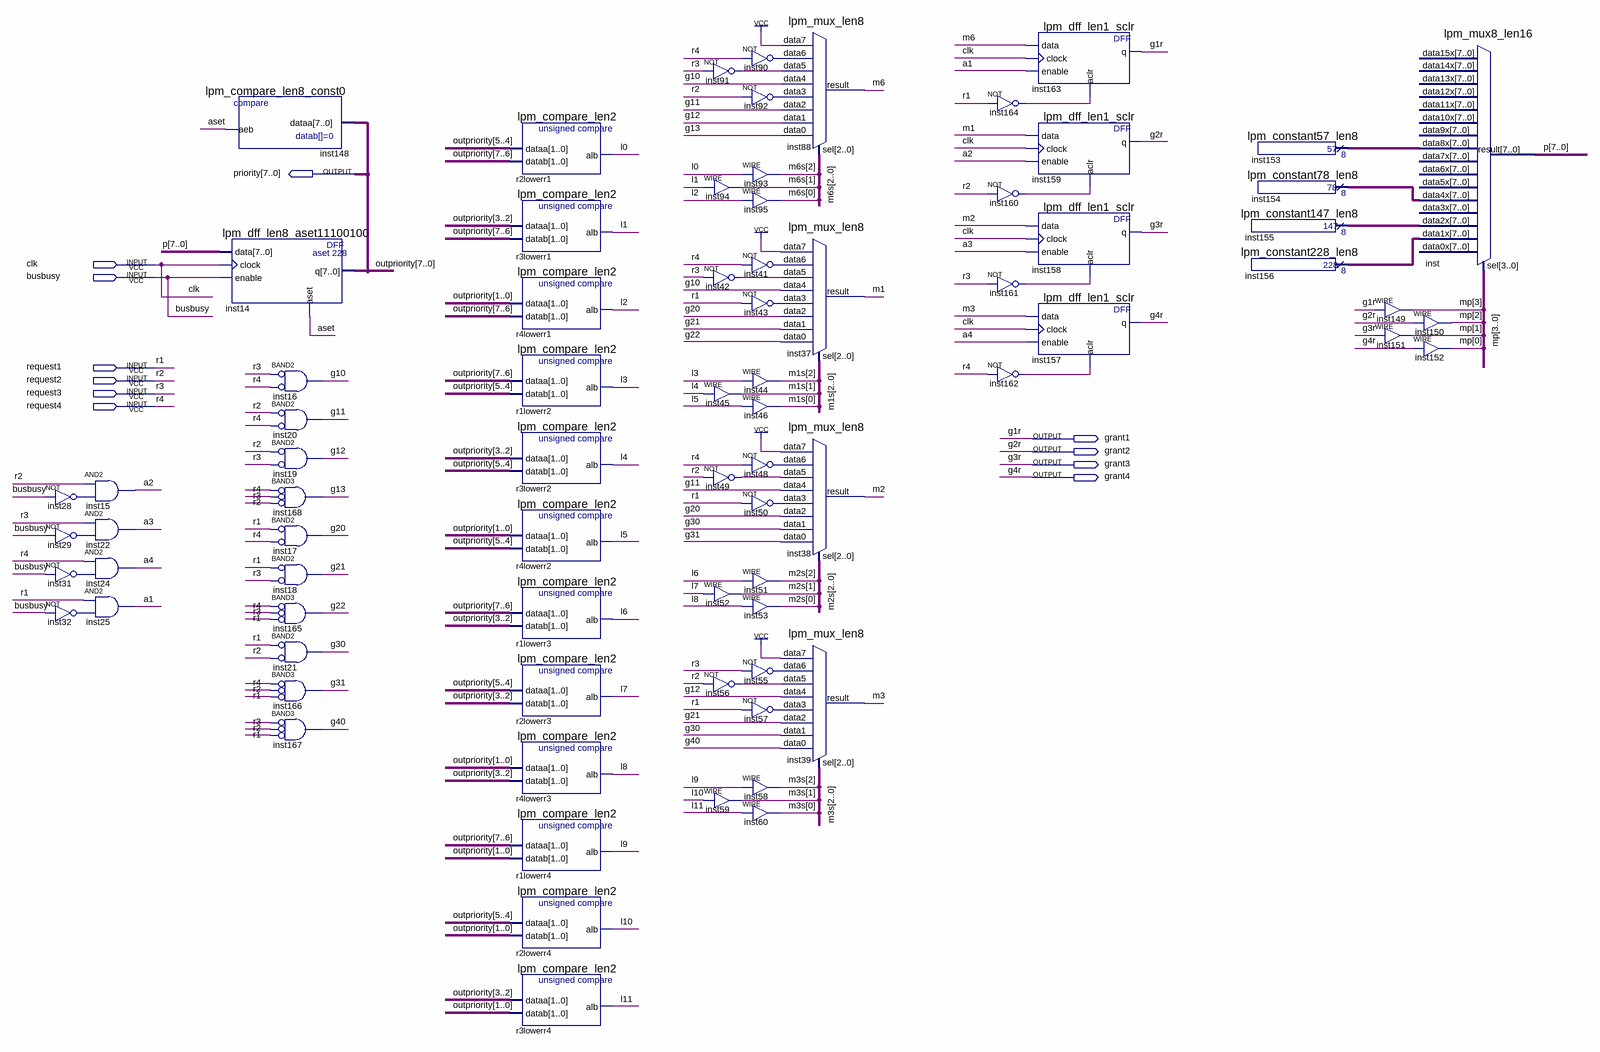
[diagram p0: schematic sheet]
// Quartus schematic Arbitor.bdf as structural Verilog: 77 symbols, 11 pins
module Arbitor (
  input  clk,
  input  busbusy,
  input  request1,
  input  request2,
  input  request3,
  input  request4,
  output [7:0] \priority ,
  output grant1,
  output grant2,
  output grant3,
  output grant4
);

  wire a1, a2, a3, a4, aset, g10, g11, g12, g13, g20, g21, g22, g30, g31, g40, inst28_out, inst29_out,
       inst31_out, inst32_out, inst41_out, inst42_out, inst43_out, inst48_out, inst49_out, inst50_out,
       inst55_out, inst56_out, inst57_out, inst90_out, inst91_out, inst92_out, inst160_out, inst161_out,
       inst162_out, inst164_out, l0, l1, l2, l3, l4, l5, l6, l7, l8, l9, l10, l11, m1, m2, m3, m6;
  wire [2:0] m1s, m2s, m3s, m6s;
  wire [3:0] mp;
  wire [7:0] inst153_result, inst154_result, inst155_result, inst156_result, p;

  not inst28 (inst28_out, busbusy);
  not inst29 (inst29_out, busbusy);
  not inst31 (inst31_out, busbusy);
  not inst32 (inst32_out, busbusy);
  and inst15 (a2, request2, inst28_out);
  and inst22 (a3, request3, inst29_out);
  and inst24 (a4, request4, inst31_out);
  and inst25 (a1, request1, inst32_out);
  lpm_compare_len8_const0 inst148 (.dataa(\priority ), .aeb(aset));
  lpm_dff_len8_aset11100100 inst14 (.data(p), .clock(clk), .enable(busbusy), .aset(aset), .q(\priority ));
  and inst16 (g10, ~request3, ~request4);  // BAND2
  and inst20 (g11, ~request2, ~request4);  // BAND2
  and inst19 (g12, ~request2, ~request3);  // BAND2
  and inst168 (g13, ~request4, ~request3, ~request2);  // BAND3
  and inst17 (g20, ~request1, ~request4);  // BAND2
  and inst18 (g21, ~request1, ~request3);  // BAND2
  and inst165 (g22, ~request4, ~request3, ~request1);  // BAND3
  and inst21 (g30, ~request1, ~request2);  // BAND2
  and inst166 (g31, ~request4, ~request2, ~request1);  // BAND3
  and inst167 (g40, ~request3, ~request2, ~request1);  // BAND3
  lpm_compare_len2 r2lowerr1 (.dataa(\priority [5:4]), .datab(\priority [7:6]), .alb(l0));
  lpm_compare_len2 r3lowerr1 (.dataa(\priority [3:2]), .datab(\priority [7:6]), .alb(l1));
  lpm_compare_len2 r4lowerr1 (.dataa(\priority [1:0]), .datab(\priority [7:6]), .alb(l2));
  lpm_compare_len2 r1lowerr2 (.dataa(\priority [7:6]), .datab(\priority [5:4]), .alb(l3));
  lpm_compare_len2 r3lowerr2 (.dataa(\priority [3:2]), .datab(\priority [5:4]), .alb(l4));
  lpm_compare_len2 r4lowerr2 (.dataa(\priority [1:0]), .datab(\priority [5:4]), .alb(l5));
  lpm_compare_len2 r1lowerr3 (.dataa(\priority [7:6]), .datab(\priority [3:2]), .alb(l6));
  lpm_compare_len2 r2lowerr3 (.dataa(\priority [5:4]), .datab(\priority [3:2]), .alb(l7));
  lpm_compare_len2 r4lowerr3 (.dataa(\priority [1:0]), .datab(\priority [3:2]), .alb(l8));
  lpm_compare_len2 r1lowerr4 (.dataa(\priority [7:6]), .datab(\priority [1:0]), .alb(l9));
  lpm_compare_len2 r2lowerr4 (.dataa(\priority [5:4]), .datab(\priority [1:0]), .alb(l10));
  lpm_compare_len2 r3lowerr4 (.dataa(\priority [3:2]), .datab(\priority [1:0]), .alb(l11));
  not inst91 (inst91_out, request3);
  assign m6s[1] = l1;  // WIRE inst94
  not inst42 (inst42_out, request3);
  assign m1s[1] = l4;  // WIRE inst45
  not inst49 (inst49_out, request2);
  assign m2s[1] = l7;  // WIRE inst52
  not inst56 (inst56_out, request2);
  assign m3s[1] = l10;  // WIRE inst59
  lpm_mux_len8 inst88 (
    .data7(1'b1), .data6(inst90_out), .data5(inst91_out), .data4(g10), .data3(inst92_out), .data2(g11),
    .data1(g12), .data0(g13), .sel(m6s), .result(m6));
  not inst90 (inst90_out, request4);
  not inst92 (inst92_out, request2);
  assign m6s[2] = l0;  // WIRE inst93
  assign m6s[0] = l2;  // WIRE inst95
  lpm_mux_len8 inst37 (
    .data7(1'b1), .data6(inst41_out), .data5(inst42_out), .data4(g10), .data3(inst43_out), .data2(g20),
    .data1(g21), .data0(g22), .sel(m1s), .result(m1));
  not inst41 (inst41_out, request4);
  not inst43 (inst43_out, request1);
  assign m1s[2] = l3;  // WIRE inst44
  assign m1s[0] = l5;  // WIRE inst46
  lpm_mux_len8 inst38 (
    .data7(1'b1), .data6(inst48_out), .data5(inst49_out), .data4(g11), .data3(inst50_out), .data2(g20),
    .data1(g30), .data0(g31), .sel(m2s), .result(m2));
  not inst48 (inst48_out, request4);
  not inst50 (inst50_out, request1);
  assign m2s[2] = l6;  // WIRE inst51
  assign m2s[0] = l8;  // WIRE inst53
  lpm_mux_len8 inst39 (
    .data7(1'b1), .data6(inst55_out), .data5(inst56_out), .data4(g12), .data3(inst57_out), .data2(g21),
    .data1(g30), .data0(g40), .sel(m3s), .result(m3));
  not inst55 (inst55_out, request3);
  not inst57 (inst57_out, request1);
  assign m3s[2] = l9;  // WIRE inst58
  assign m3s[0] = l11;  // WIRE inst60
  not inst164 (inst164_out, request1);
  not inst160 (inst160_out, request2);
  not inst161 (inst161_out, request3);
  not inst162 (inst162_out, request4);
  lpm_dff_len1_sclr inst163 (.data(m6), .clock(clk), .enable(a1), .aclr(inst164_out), .q(grant1));
  lpm_dff_len1_sclr inst159 (.data(m1), .clock(clk), .enable(a2), .aclr(inst160_out), .q(grant2));
  lpm_dff_len1_sclr inst158 (.data(m2), .clock(clk), .enable(a3), .aclr(inst161_out), .q(grant3));
  lpm_dff_len1_sclr inst157 (.data(m3), .clock(clk), .enable(a4), .aclr(inst162_out), .q(grant4));
  lpm_constant57_len8 inst153 (.result(inst153_result));
  lpm_constant78_len8 inst154 (.result(inst154_result));
  lpm_constant147_len8 inst155 (.result(inst155_result));
  lpm_constant228_len8 inst156 (.result(inst156_result));
  assign mp[3] = grant1;  // WIRE inst149
  assign mp[1] = grant3;  // WIRE inst151
  lpm_mux8_len16 inst (
    .data8x(inst153_result), .data4x(inst154_result), .data2x(inst155_result), .data1x(inst156_result),
    .sel(mp), .result(p));  // open: data15x, data14x, data13x, data12x, data11x, data10x, data9x, data7x, data6x, data5x, data3x, data0x
  assign mp[2] = grant2;  // WIRE inst150
  assign mp[0] = grant4;  // WIRE inst152

  // Other names for the same wires on the sheet: g1r = grant1; g2r = grant2; g3r = grant3; g4r = grant4;
  //   outpriority[7:0] = \priority ; r1 = request1; r2 = request2; r3 = request3; r4 = request4
endmodule
